# Altium schematic sheet ESP8266-12F_Board.SchDoc
size A3; Organization: Senic GmbH; Address1: Aufgang J; Address2: Köpenicker Str. 154; Address3: Berlin 10997; Address4: Germany
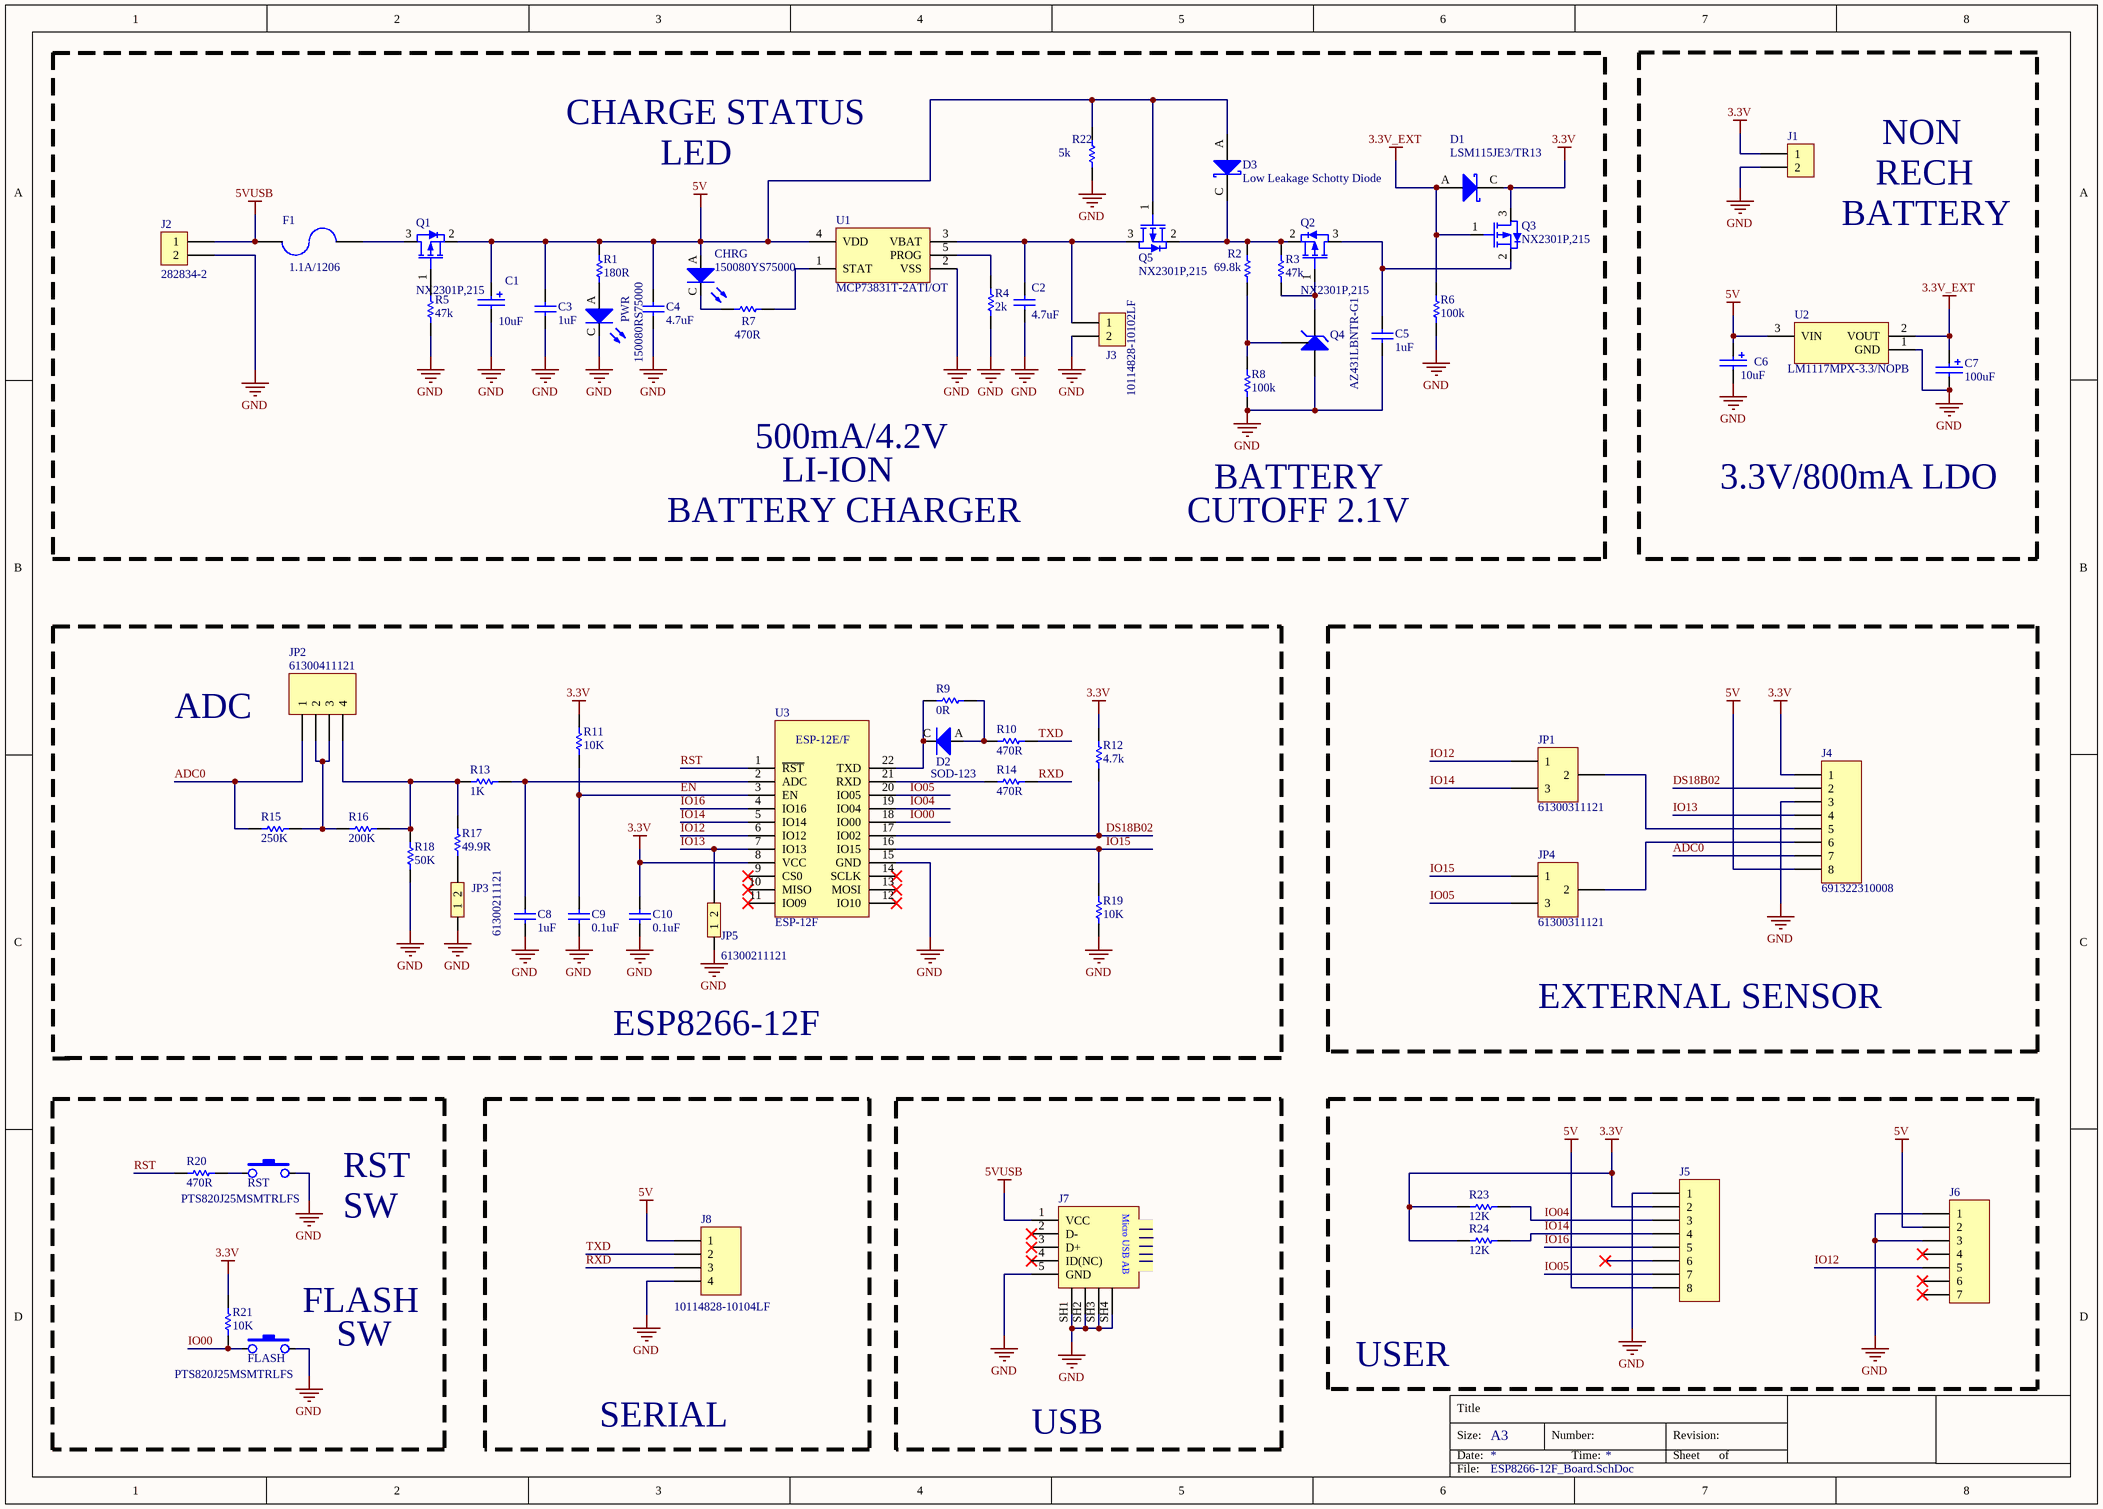
[diagram p0: ESP8266-12F_Board.SchDoc]

## Parts
C1  10uF  [C1206+0805-Polar]
C2  4.7uF  [C0603]
C3  1uF  [C0603]
C4  4.7uF  [C0603]
C5  1uF  [C0603]
C6  10uF  [C1206+0805-Polar]
C7  100uF  [CAP_ALU_D6.3_H7.7]
C8  1uF  [C0603]
C9  0.1uF  [C0603]
C10  0.1uF  [C0603]
CHRG  150080YS75000  [LED_0805_Red]
D1  LSM115JE3/TR13  [DO-214AC(SMA)]
D2  SOD-123  [SOD-123]
D3  Low Leakage Schotty Diode  [SOD-323]
F1  1.1A/1206  [FUSE_1206-(1206L300SLTHYR)]
FLASH  PTS820J25MSMTRLFS  [SPST-TACT-SMD-(PTS820J25MSMTRLFS)]
J1  B2B-XH-A(LF)(SN)  [HDR1X2-P2.5-JST-(B2B-XH-A(LF)(SN))]  (value not drawn)
J2  282834-2  [TB1X2_P2.54-(282834-2)]
J3  10114828-10102LF  [HDR1X2_SMD_P1.25-(10114828-10102LF)]
J4  691322310008  [TB-RA-1X8-(691322310008)]
J5  75915-308LF  [HDR1X8_FEMALE-(75915-308LF)]  (value not drawn)
J6  0901471107  [HDR1X7_FEMALE-(0901471107)]  (value not drawn)
J7  USB-MICRO  [USB_MICRO_SMD-2]  (value not drawn)
J8  10114828-10104LF  [HDR1X4_SMD_P1.25-(10114828-10104LF)]
JP1  61300311121  [HDR1X3_MALE-(61300311121)]
JP2  61300411121  [HDR1X4_MALE-(61300411121)]
JP3  61300211121  [HDR1X2_MALE-(61300211121)]
JP4  61300311121  [HDR1X3_MALE-(61300311121)]
JP5  61300211121  [HDR1X2_MALE-(61300211121)]
PWR  150080RS75000  [LED_0805_Red]
Q1  NX2301P,215  [SOT23-3]
Q2  NX2301P,215  [SOT23-3]
Q3  NX2301P,215  [SOT23-3]
Q4  AZ431LBNTR-G1  [SOT23-3]
Q5  NX2301P,215  [SOT23-3]
R1  180R  [R0603]
R2  69.8k  [R0603]
R3  47k  [R0603]
R4  2k  [R0603]
R5  47k  [R0603]
R6  100k  [R0603]
R7  470R  [R0603]
R8  100k  [R0603]
R9  0R  [R0603]
R10  470R  [R0603]
R11  10K  [R0603]
R12  4.7k  [R0603]
R13  1K  [R0603]
R14  470R  [R0603]
R15  250K  [R0603]
R16  200K  [R0603]
R17  49.9R  [R0603]
R18  50K  [R0603]
R19  10K  [R0603]
R20  470R  [R0603]
R21  10K  [R0603]
R22  5k  [R0603]
R23  12K  [R0603]
R24  12K  [R0603]
RST  PTS820J25MSMTRLFS  [SPST-TACT-SMD-(PTS820J25MSMTRLFS)]
U1  MCP73831T-2ATI/OT  [SOT23-5]
U2  LM1117MPX-3.3/NOPB  [SOT-223-4]
U3  ESP-12F  [ESP_12E/F]

## Blocks framed on the sheet
EXTERNAL SENSOR: J4 JP1 JP4
SERIAL: J8
USB: J7
USER: J5 J6 R23 R24

## Nets
3.3V: C10.2 D1.C J1.1 J4.1 J5.2 Q3.3(D) R11.2 R12.1 R21.1 R23.2 R24.2 U3.8(VCC)
3.3V_EXT: C7.1 D1.A Q3.1(G) R6.1 U2.2(VOUT)
5V: C1.1 C3.2 C4.2 C6.1 CHRG.A D3.A J4.8 J5.8 J6.2 J8.1 Q1.2(S) Q5.1(G) R1.2 R22.1 U1.4(VDD) U2.3(VIN)
5VUSB: F1.1 J2.1 J7.1(VCC)
GND: C1.2 C2.1 C3.1 C4.1 C5.1 C6.2 C7.2 C8.1 C9.1 C10.1 FLASH.2 J1.2 J2.2 J3.2 J4.3 J5.1 J6.1 J6.3 J7.5(GND) J7.SH1 J7.SH2 J7.SH3 J7.SH4 J8.4 JP3.1 JP5.1 PWR.C Q4.3(A) R4.2 R5.1 R6.2 R8.2 R18.1 R19.2 R22.2 RST.2 U1.2(VSS) U2.1(GND) U3.15(GND)
ADC0: J4.7 JP2.1 R15.2
DS18B02: J4.2 R12.2 U3.17(IO02)
EN: C9.2 R11.1 U3.3(EN)
IO00: FLASH.1 R21.2 U3.18(IO00)
IO04: J5.3 R23.1 U3.19(IO04)
IO05: J5.7 JP4.3 U3.20(IO05)
IO12: J6.5 JP1.1 U3.6(IO12)
IO13: J4.4 JP5.2 U3.7(IO13)
IO14: J5.4 JP1.3 R24.1 U3.5(IO14)
IO15: JP4.1 R19.1 U3.16(IO15)
IO16: J5.5 U3.4(IO16)
RST: R20.2 U3.1(~{RST})
RXD: J8.3 R14.1
TXD: J8.2 R10.1
NetC2_2: C2.2 J3.1 Q5.3(D) U1.3(VBAT)
NetC5_2: C5.2 Q2.3(D) Q3.2(S)
NetC8_2: C8.2 R13.2 U3.2(ADC)
NetCHRG_C: CHRG.C R7.2
NetD2_A: D2.A R9.1 R10.2
NetD2_C: D2.C R9.2 U3.22(TXD)
NetD3_C: D3.C Q2.2(S) Q5.2(S) R2.1 R3.1
NetF1_2: F1.2 Q1.3(D)
NetJ4_5: J4.5 JP1.2
NetJ4_6: J4.6 JP4.2
NetJP2_2: JP2.2 JP2.3 R15.1 R16.2
NetJP2_4: JP2.4 R13.1 R16.1 R17.1 R18.2
NetJP3_2: JP3.2 R17.2
NetPWR_A: PWR.A R1.1
NetQ1_1: Q1.1(G) R5.2
NetQ2_1: Q2.1(G) Q4.2(C) R3.2
NetQ4_1: Q4.1(REF) R2.2 R8.1
NetR4_1: R4.1 U1.5(PROG)
NetR7_1: R7.1 U1.1(STAT)
NetR14_2: R14.2 U3.21(RXD)
NetR20_1: R20.1 RST.1

Not connected (* = marked no-connect by the designer): J5 6*; J6 4* 6* 7*; J7 2(D-)* 3(D+)* 4(ID(NC))*; U3 9(CS0)* 10(MISO)* 11(IO09)* 12(IO10)* 13(MOSI)* 14(SCLK)*

## Notes on the sheet
- CHARGE STATUS
- LED
- NON
- BATTERY
- RECH
- 500mA/4.2V
- LI-ION
- 3.3V/800mA LDO
- BATTERY CHARGER
- CUTOFF 2.1V
- ADC
- ESP8266-12F
- RST
- SW
- (near FLASH) FLASH
- (near FLASH) SW
- Title
- Size:
- Date:
- A3
- Number:
- Time:
- Revision:
- Sheet
- of
- File:
- (in symbol USB-MICRO) Micro USB AB

## Library data of the parts
C1 C6 C7 = CAP_POLAR
C2-C5 C8-C10 = CAP_CERAMIC
CHRG PWR = LED
D1 D3 = SCHOTTKY
D2 = DIODE
F1 = FUSE-2PIN
FLASH RST = SPST-TACT
J1-J3 = HDR1X2
J4 J5 = HDR1X8
J6 = HDR1X7
J8 JP2 = HDR1X4
JP1 JP4 = JUMPER_3PIN
JP3 JP5 = JUMPER-2PIN
Q1-Q3 Q5 = PMOS
R1-R24 = RES: MFR Part No.: *
U3 = ESP-12E/F: Class 2 embedded Bluetooth 4.0 module; Unit Price@1k: $; MFR Part No: *
U1 = MCP73831T-2ATI/OT: MFR Part No.: MCP73831T-2ATI/OT
U2 = LM1117MPX-3.3/NOPB: MFR Part No.: LM1117MPX-3.3/NOPB